# EAGLE design jtag-adaptor (EAGLE 9.6.2)
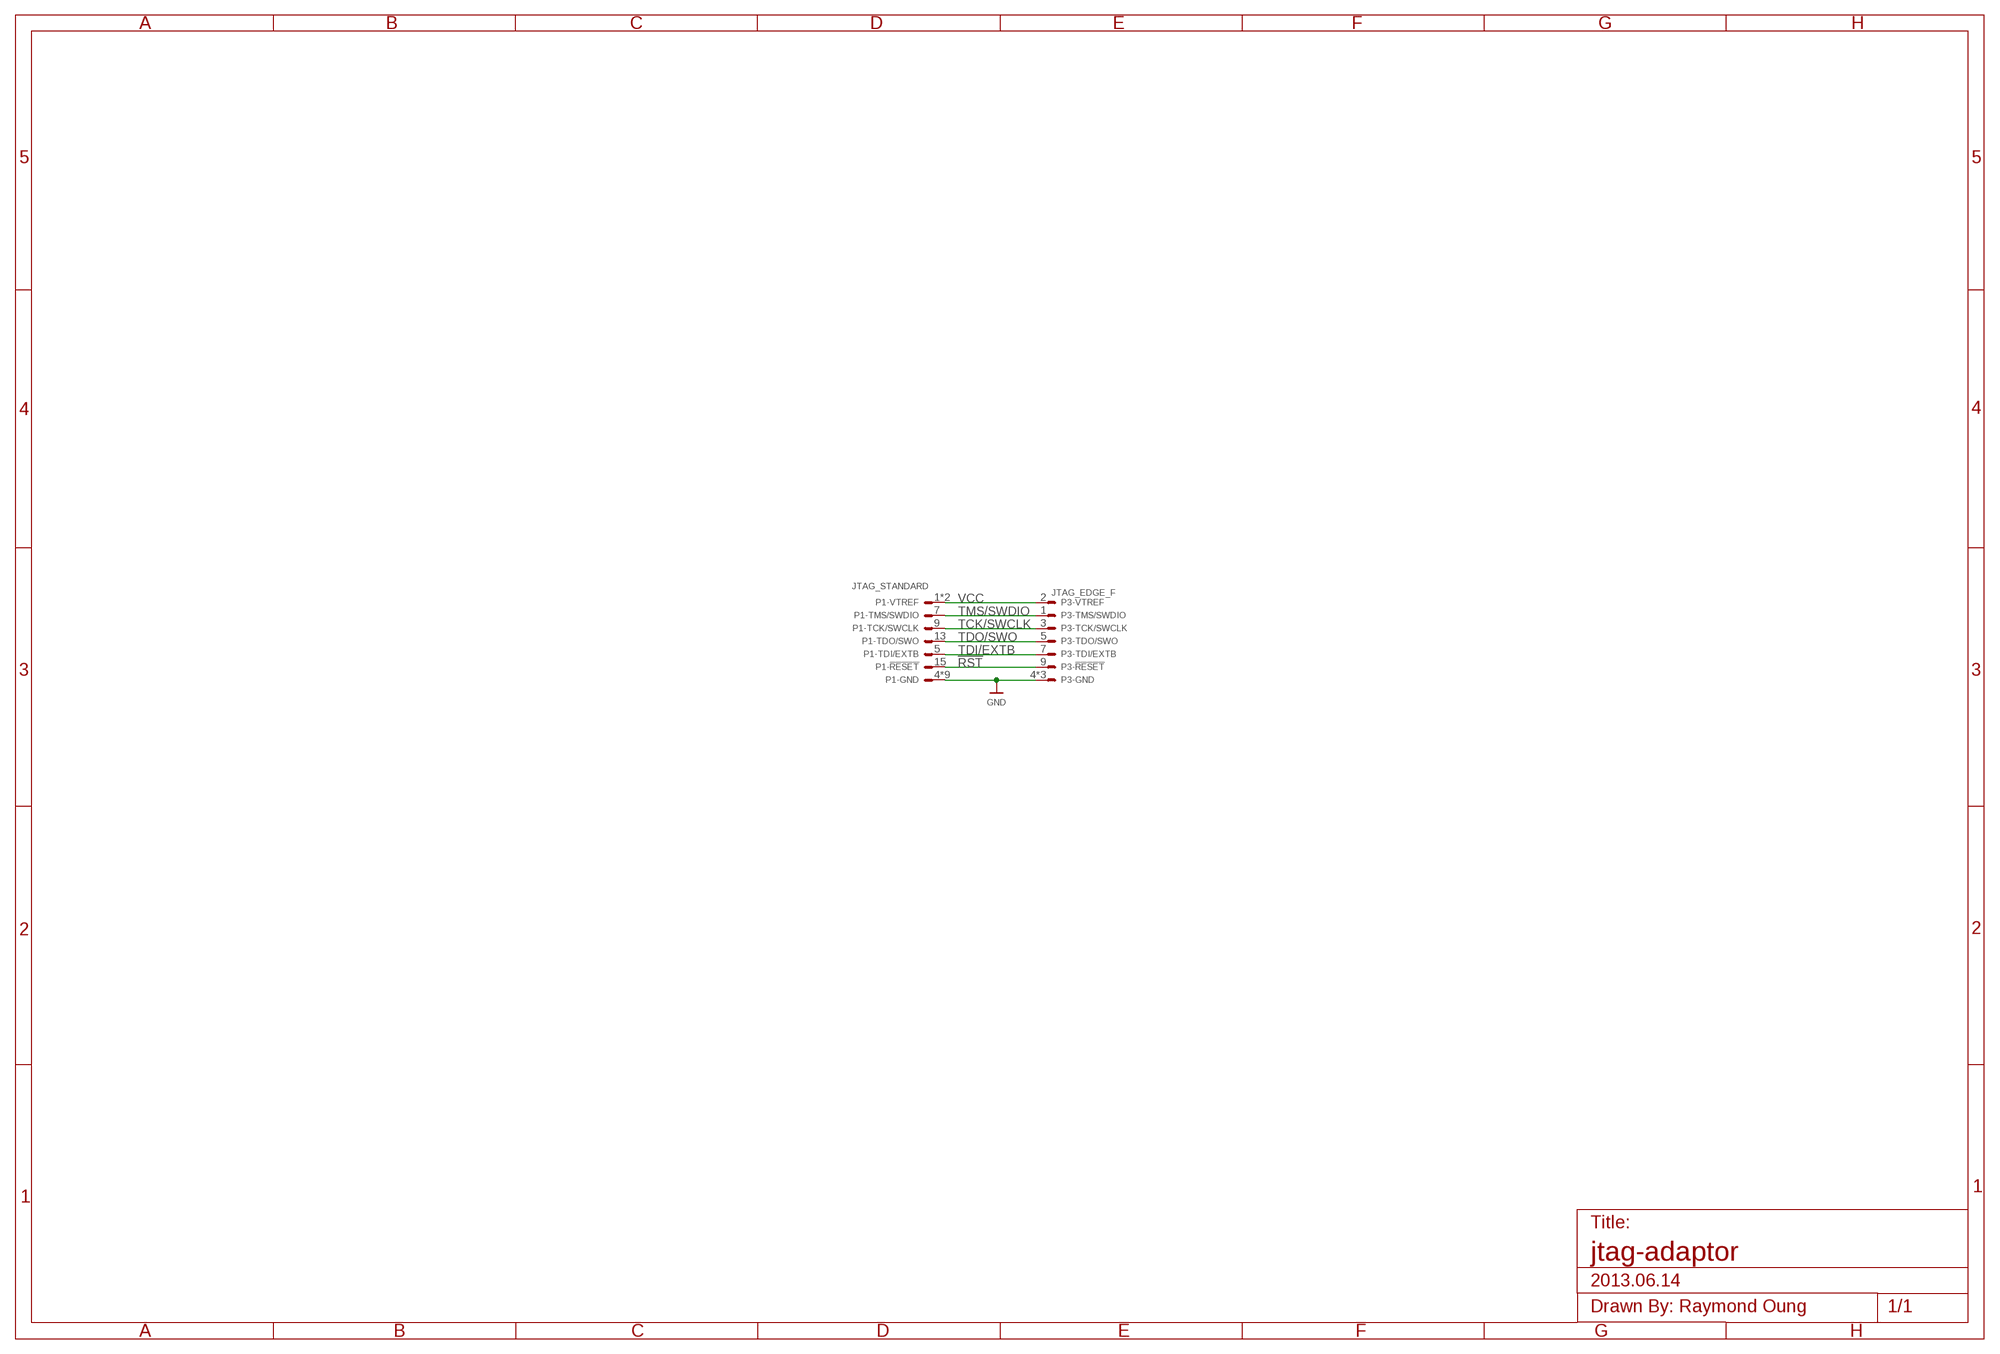
[diagram p0: schematic, sheet 1]

## Parts
P1  JTAG_STANDARD  JTAG_2X10  [2X10_LOCK]
P3  JTAG_EDGE_F  [FTSH-105-01-XXX-DV-EDGE]

## Nets
!RST: P1.15 P3.9
GND: P1.4 P1.6 P1.8 P1.10 P1.12 P1.14 P1.16 P1.18 P1.20 P3.4 P3.6 P3.10
TCK/SWCLK: P1.9 P3.3
TDI/EXTB: P1.5 P3.7
TDO/SWO: P1.13 P3.5
TMS/SWDIO: P1.7 P3.1
VCC: P1.1 P1.2 P3.2

## Notes on the sheet
- 2013.06.14

## Library data of the parts
P1 = custom-connectors:JTAG: JTAG Connector; DIGI-KEY: S9180-ND
P3 = custom-connectors:JTAG: JTAG Connector; DIGI-KEY: 952-1365-5-ND; MOUSER: 855-M50-3000545

## Net classes
0 default: width 0.254 mm, drill 0.305 mm, clearance 0.254 mm

## Board
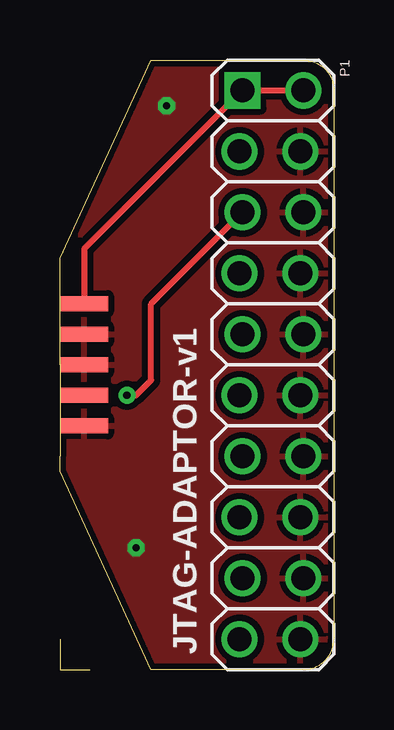
[diagram p1: board, top side]
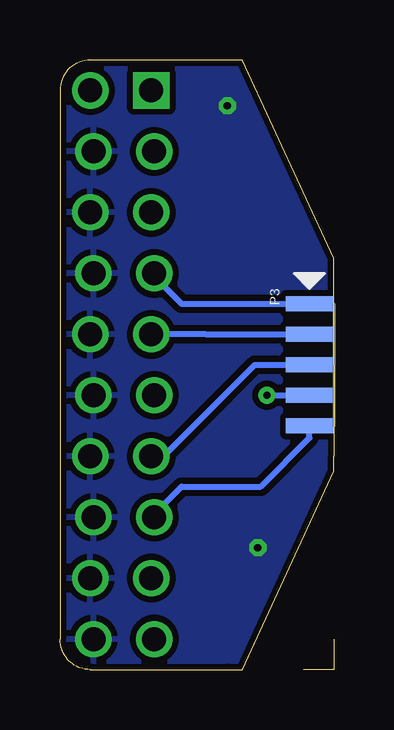
[diagram p2: board, bottom side, seen from below]

Size 11.43 x 25.4 mm. Coordinates in mm from the lower left corner, seen from the top.
Outline: 1.27,0 0,0 0,1.27
Outline: 10.16,0 arc90 11.43,1.27 11.43,24.13 arc90 10.16,25.4 3.81,25.4 0,17.14 0,16.51 0,12.7 0,8.89 0,8.26 3.81,0 4.45,0 10.16,0
Copper layers (1*16): Top 0.035mm / dielectric 1.5mm / Bottom 0.035mm
Design rules "ITEADstudio_DRC-2layer *": minimum track width 10mil, minimum drill 12mil, track to track 8mil, track to pad 8mil, pad to pad 8mil, via to via 8mil, smd to smd 0mil, copper to edge 10mil, drill to drill 10mil, minimum pad ring 10mil, minimum via ring 8mil, stop-mask expansion 2mil, vias tented up to drill 100mil, thermal gap 10mil

### Footprints (pad centres in the part's own frame; a part is rotated, then mirrored left to right if it is on the bottom)
2X10_LOCK = drill 1 square: 1 -11.43,-1.27 | drill 1: 2 -11.43,1.27; 3 -8.89,-1.397; 4 -8.89,1.143; 5 -6.35,-1.27; 6 -6.35,1.27; 7 -3.81,-1.397; 8 -3.81,1.143; 9 -1.27,-1.27; 10 -1.27,1.27; 11 1.27,-1.397; 12 1.27,1.143; 13 3.81,-1.27; 14 3.81,1.27; 15 6.35,-1.397; 16 6.35,1.143; 17 8.89,-1.27; 18 8.89,1.27; 19 11.43,-1.397; 20 11.43,1.143
FTSH-105-01-XXX-DV-EDGE = smd 0.635 x 2: 1 -2.54,-1; 3 -1.27,-1; 5 0,-1; 7 1.27,-1; 9 2.54,-1 | smd 0.635 x 2 bottom: 2 -2.54,-1; 4 -1.27,-1; 6 0,-1; 8 1.27,-1; 10 2.54,-1

### Placement (x,y rotation side)
P1  8.89,12.7 270 top
P3  0,12.7 270 bottom

### Tracks (layer width: path | path; a pad name or v marks a point on that pad's centre or on a via)
!RST
  Bottom 0.254: P3.9 1.02,10.16 1.02,9.65 3.05,7.62 6.35,7.62 7.62,6.35 P1.15
GND  (via drill 0.3)
  other vias: 4.45,23.5 3.17,5.08
  pour Bottom: 3.81,0 10.16,0 arc90 11.43,1.27 11.43,24.13 arc90 10.16,25.4 3.81,25.4 0,17.14 0,8.26
  pour Top: 3.81,0 10.16,0 arc90 11.43,1.27 11.43,24.13 arc90 10.16,25.4 3.81,25.4 0,17.14 0,8.26
TCK/SWCLK
  Bottom 0.254: P3.3 1.02,13.97 5.33,13.97 P1.9
TDI/EXTB  (via drill 0.3)
  Top 0.254: v2.79,11.43 3.17,11.43 3.81,12.06 3.81,15.24 P1.5
  Bottom 0.254: v2.79,11.43 1.02,11.43 P3.7
TDO/SWO
  Bottom 0.254: P1.13 7.11,8.89 3.3,12.7 1.02,12.7 P3.5
TMS/SWDIO
  Bottom 0.254: 1.02,15.24 P3.1 2.79,15.24 6.35,15.24 7.62,16.51 P1.7
VCC
  Top 0.254: P3.2 1.02,15.24 1.02,17.53 P1.1 P1.2

### Text on the board
tPlace: JTAG-ADAPTOR-v1